# Altium schematic sheet FuenteAlimentacionTop.SchDoc
size A4
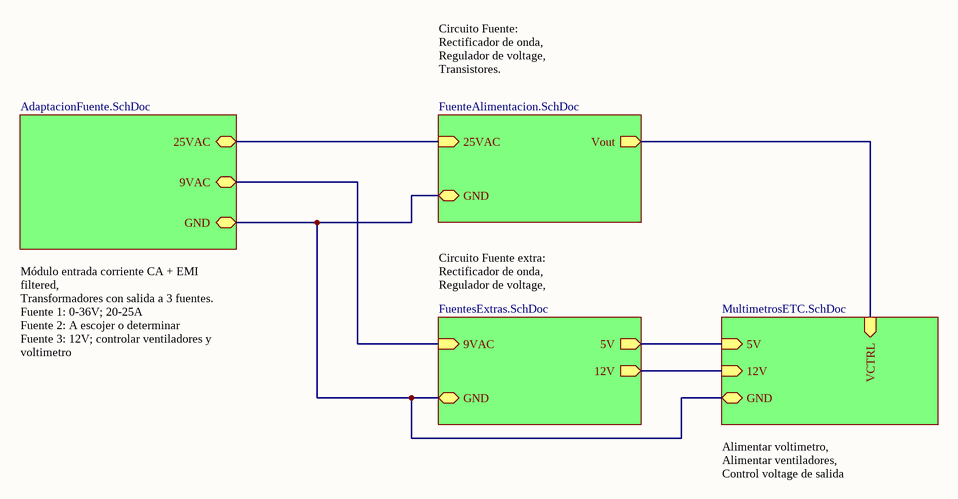
[diagram p0: FuenteAlimentacionTop.SchDoc]

## Sub-sheets
? = FuenteAlimentacion.SchDoc: 25VAC (in), GND, Vout (out)
? = AdaptacionFuente.SchDoc: 25VAC, GND, 9VAC
? = FuentesExtras.SchDoc: 9VAC (in), GND, 5V (out), 12V (out)
? = MultimetrosETC.SchDoc: 5V (in), GND, 12V (in), VCTRL (in)

## Nets
(unnamed): sheet /25VAC, sheet /25VAC
(unnamed): sheet /GND, sheet /GND, sheet /GND, sheet /GND
(unnamed): sheet /Vout, sheet /VCTRL
(unnamed): sheet /9VAC, sheet /9VAC
(unnamed): sheet /5V, sheet /5V
(unnamed): sheet /12V, sheet /12V

## Notes on the sheet
- Circuito Fuente:
  Rectificador de onda,
  Regulador de voltage,
  Transistores.
- Circuito Fuente extra:
  Rectificador de onda,
  Regulador de voltage,
- Módulo entrada corriente CA + EMI filtered,
  Transformadores con salida a 3 fuentes.
  Fuente 1: 0-36V; 20-25A
  Fuente 2: A escojer o determinar
  Fuente 3: 12V; controlar ventiladores y  voltimetro
- Alimentar voltimetro,
  Alimentar ventiladores,
  Control voltage de salida